# EAGLE design Interconnect (EAGLE 4.16)
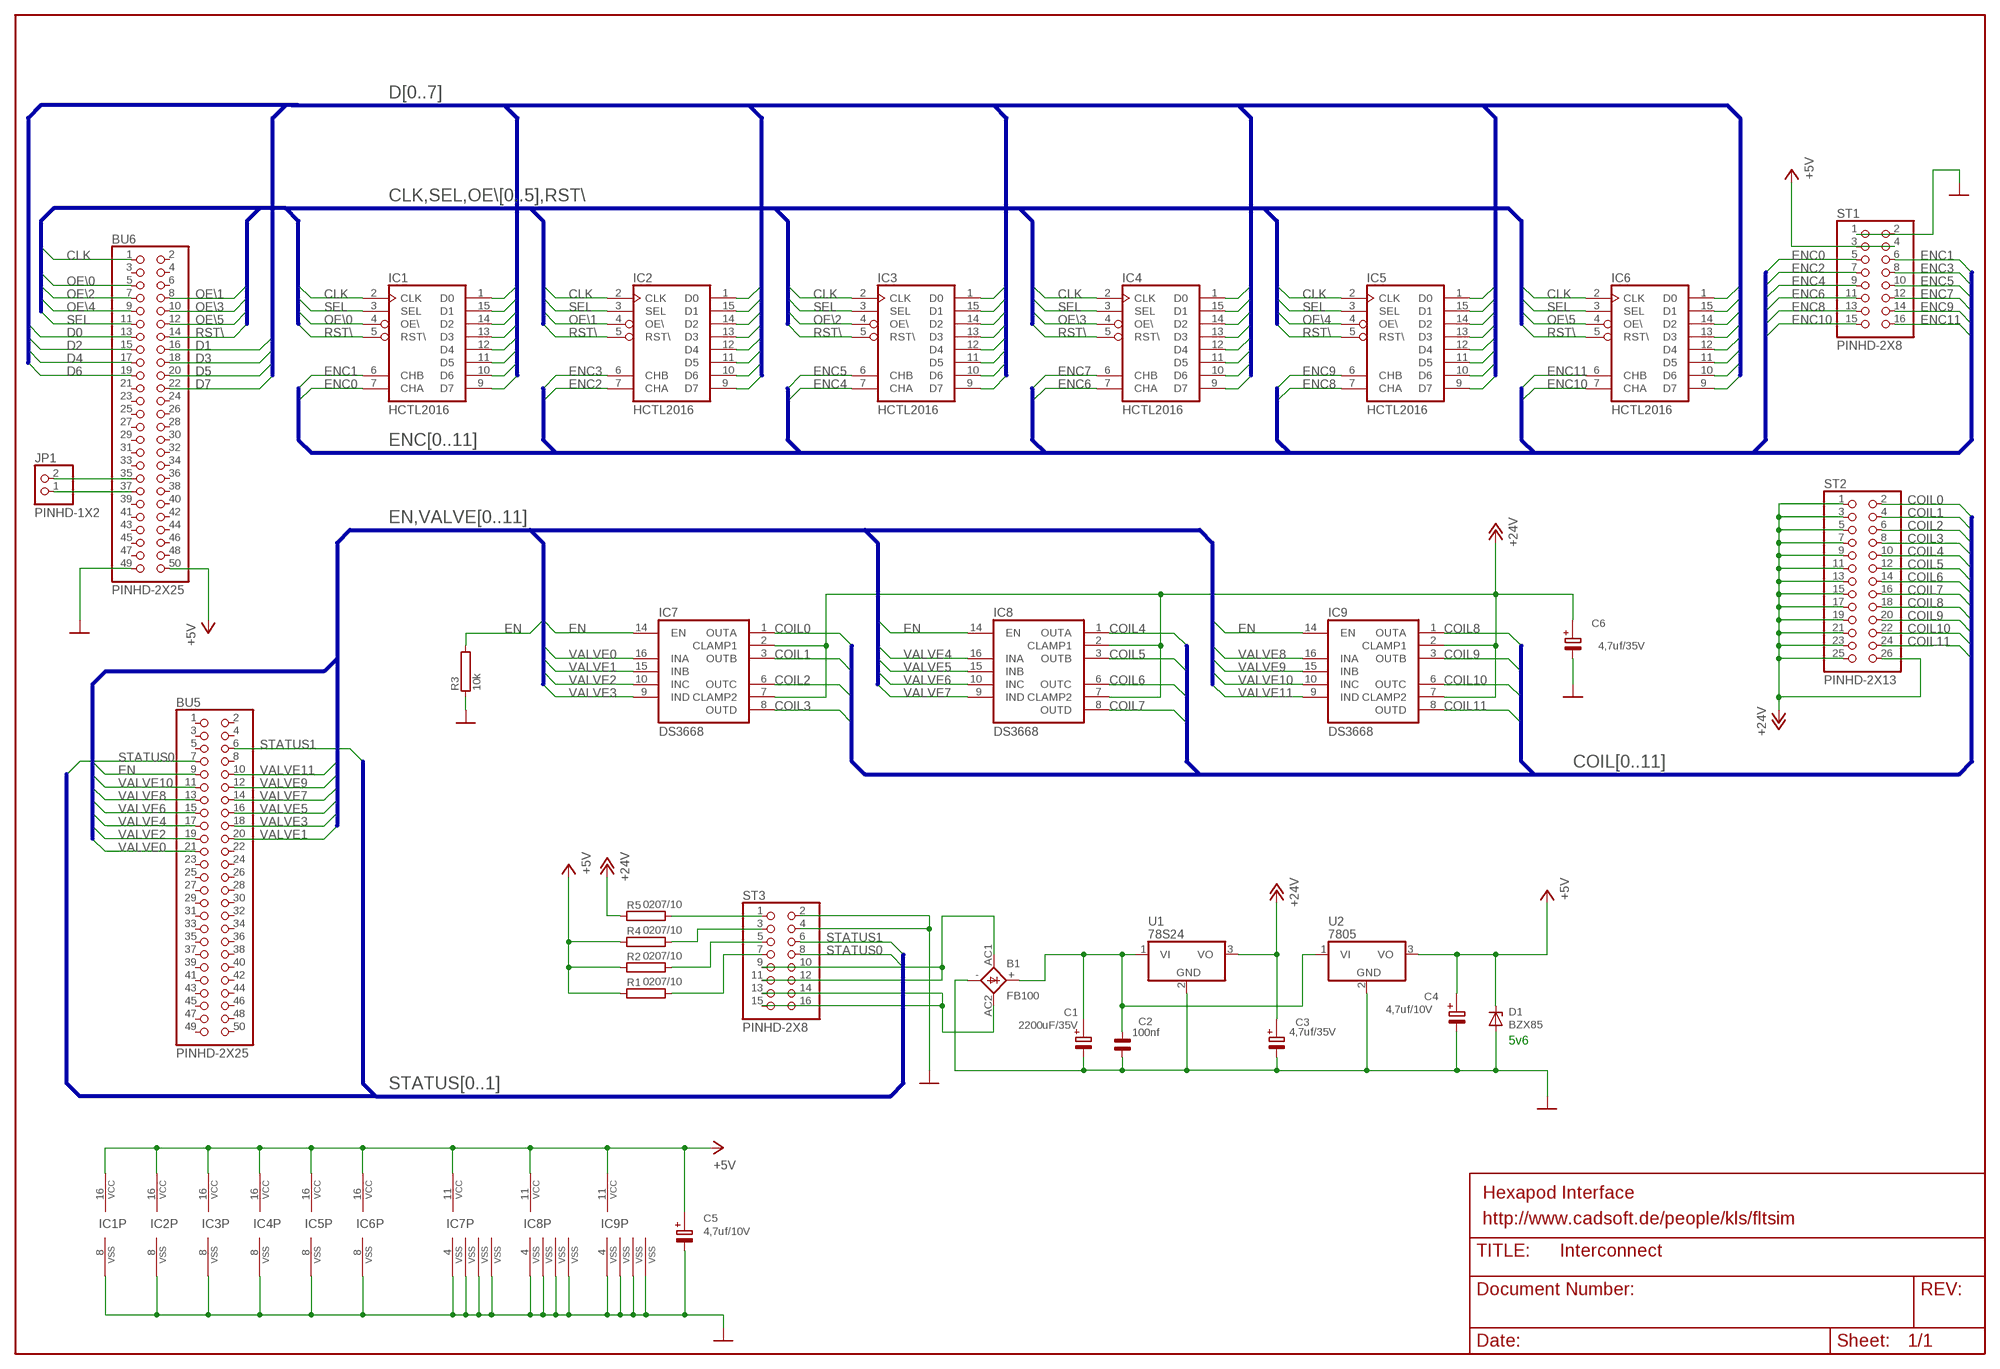
[diagram p0: schematic, sheet 1]

## Parts
B1  FB100  [FB100]
BU5  PINHD-2X25  [2X25]
BU6  PINHD-2X25  [2X25]
C1  2200uF/35V  E35-16  [E35-16]
C2  100nf  C5B2,5A  [C5B2,5A]
C3  4,7uf/35V  E2-5@1  [E2,5-5]
C4  4,7uf/10V  E2,5-5  [E2,5-5]
C5  4,7uf/10V  E2,5-5  [E2,5-5]
C6  4,7uf/35V  E2-5@1  [E2,5-5]
D1  BZX85  [DO41Z10]
IC1  HCTL2016  [DIL-16]
IC2  HCTL2016  [DIL-16]
IC3  HCTL2016  [DIL-16]
IC4  HCTL2016  [DIL-16]
IC5  HCTL2016  [DIL-16]
IC6  HCTL2016  [DIL-16]
IC7  DS3668  [DIL-16]
IC8  DS3668  [DIL-16]
IC9  DS3668  [DIL-16]
JP1  PINHD-1X2  [1X02]
R1  0207/10  [0207/10]
R2  0207/10  [0207/10]
R3  10k  0207/10@1  [0207/10@1]
R4  0207/10  [0207/10]
R5  0207/10  [0207/10]
ST1  PINHD-2X8  PINHD-2X8@1  [ML16]
ST2  PINHD-2X13  PINHD-2X13@1  [ML26]
ST3  PINHD-2X8  PINHD-2X8@1  [ML16]
U1  78S24  78XXT  [TO220H]
U2  7805  78XXT  [TO220H]

## Nets
+5V: BU6.50 C4.+ C5.+ D1.K IC1.16(VCC) IC2.16(VCC) IC3.16(VCC) IC4.16(VCC) IC5.16(VCC) IC6.16(VCC) IC7.11(VCC) IC8.11(VCC) IC9.11(VCC) R1.1 R2.1 R4.1 ST1.3 ST1.4 U2.3(VO)
+24V: C3.+ C6.+ IC7.2(CLAMP1) IC7.7(CLAMP2) IC8.2(CLAMP1) IC8.7(CLAMP2) IC9.2(CLAMP1) IC9.7(CLAMP2) R5.1 ST2.1 ST2.3 ST2.5 ST2.7 ST2.9 ST2.11 ST2.13 ST2.15 ST2.17 ST2.19 ST2.21 ST2.23 ST2.25 ST2.26 U1.3(VO)
AC1: B1.AC1 ST3.9 ST3.10 ST3.11 ST3.12
AC2: B1.AC2 ST3.13 ST3.14 ST3.15 ST3.16
CLK: BU6.1 IC1.2(CLK) IC2.2(CLK) IC3.2(CLK) IC4.2(CLK) IC5.2(CLK) IC6.2(CLK)
COIL0: IC7.1(OUTA) ST2.2
COIL1: IC7.3(OUTB) ST2.4
COIL2: IC7.6(OUTC) ST2.6
COIL3: IC7.8(OUTD) ST2.8
COIL4: IC8.1(OUTA) ST2.10
COIL5: IC8.3(OUTB) ST2.12
COIL6: IC8.6(OUTC) ST2.14
COIL7: IC8.8(OUTD) ST2.16
COIL8: IC9.1(OUTA) ST2.18
COIL9: IC9.3(OUTB) ST2.20
COIL10: IC9.6(OUTC) ST2.22
COIL11: IC9.8(OUTD) ST2.24
D0: BU6.13 IC1.1(D0) IC2.1(D0) IC3.1(D0) IC4.1(D0) IC5.1(D0) IC6.1(D0)
D1: BU6.16 IC1.15(D1) IC2.15(D1) IC3.15(D1) IC4.15(D1) IC5.15(D1) IC6.15(D1)
D2: BU6.15 IC1.14(D2) IC2.14(D2) IC3.14(D2) IC4.14(D2) IC5.14(D2) IC6.14(D2)
D3: BU6.18 IC1.13(D3) IC2.13(D3) IC3.13(D3) IC4.13(D3) IC5.13(D3) IC6.13(D3)
D4: BU6.17 IC1.12(D4) IC2.12(D4) IC3.12(D4) IC4.12(D4) IC5.12(D4) IC6.12(D4)
D5: BU6.20 IC1.11(D5) IC2.11(D5) IC3.11(D5) IC4.11(D5) IC5.11(D5) IC6.11(D5)
D6: BU6.19 IC1.10(D6) IC2.10(D6) IC3.10(D6) IC4.10(D6) IC5.10(D6) IC6.10(D6)
D7: BU6.22 IC1.9(D7) IC2.9(D7) IC3.9(D7) IC4.9(D7) IC5.9(D7) IC6.9(D7)
EN: BU5.9 IC7.14(EN) IC8.14(EN) IC9.14(EN) R3.2
ENC0: IC1.7(CHA) ST1.5
ENC1: IC1.6(CHB) ST1.6
ENC2: IC2.7(CHA) ST1.7
ENC3: IC2.6(CHB) ST1.8
ENC4: IC3.7(CHA) ST1.9
ENC5: IC3.6(CHB) ST1.10
ENC6: IC4.7(CHA) ST1.11
ENC7: IC4.6(CHB) ST1.12
ENC8: IC5.7(CHA) ST1.13
ENC9: IC5.6(CHB) ST1.14
ENC10: IC6.7(CHA) ST1.15
ENC11: IC6.6(CHB) ST1.16
GND: B1.- BU6.49 C1.- C2.1 C3.- C4.- C5.- C6.- D1.A IC1.8(VSS) IC2.8(VSS) IC3.8(VSS) IC4.8(VSS) IC5.8(VSS) IC6.8(VSS) IC7.4(VSS) IC7.5(VSS) IC7.12(VSS) IC7.13(VSS) IC8.4(VSS) IC8.5(VSS) IC8.12(VSS) IC8.13(VSS) IC9.4(VSS) IC9.5(VSS) IC9.12(VSS) IC9.13(VSS) R3.1 ST1.1 ST1.2 ST3.2 ST3.4 U1.2(GND) U2.2(GND)
N$4: R5.2 ST3.1
N$5: R4.2 ST3.3
N$6: R2.2 ST3.5
N$7: R1.2 ST3.7
N$8: BU6.35 JP1.2
N$9: BU6.37 JP1.1
OE\0: BU6.5 IC1.4(OE\)
OE\1: BU6.8 IC2.4(OE\)
OE\2: BU6.7 IC3.4(OE\)
OE\3: BU6.10 IC4.4(OE\)
OE\4: BU6.9 IC5.4(OE\)
OE\5: BU6.12 IC6.4(OE\)
RST\: BU6.14 IC1.5(RST\) IC2.5(RST\) IC3.5(RST\) IC4.5(RST\) IC5.5(RST\) IC6.5(RST\)
SEL: BU6.11 IC1.3(SEL) IC2.3(SEL) IC3.3(SEL) IC4.3(SEL) IC5.3(SEL) IC6.3(SEL)
STATUS0: BU5.7 ST3.8
STATUS1: BU5.6 ST3.6
VALVE0: BU5.21 IC7.16(INA)
VALVE1: BU5.20 IC7.15(INB)
VALVE2: BU5.19 IC7.10(INC)
VALVE3: BU5.18 IC7.9(IND)
VALVE4: BU5.17 IC8.16(INA)
VALVE5: BU5.16 IC8.15(INB)
VALVE6: BU5.15 IC8.10(INC)
VALVE7: BU5.14 IC8.9(IND)
VALVE8: BU5.13 IC9.16(INA)
VALVE9: BU5.12 IC9.15(INB)
VALVE10: BU5.11 IC9.10(INC)
VALVE11: BU5.10 IC9.9(IND)
VIN: B1.+ C1.+ C2.2 U1.1(VI) U2.1(VI)
Unconnected: BU5.1 BU5.2 BU5.3 BU5.4 BU5.5 BU5.8 BU5.22 BU5.23 BU5.24 BU5.25 BU5.26 BU5.27 BU5.28 BU5.29 BU5.30 BU5.31 BU5.32 BU5.33 BU5.34 BU5.35 BU5.36 BU5.37 BU5.38 BU5.39 BU5.40 BU5.41 BU5.42 BU5.43 BU5.44 BU5.45 BU5.46 BU5.47 BU5.48 BU5.49 BU5.50 BU6.2 BU6.3 BU6.4 BU6.6 BU6.21 BU6.23 BU6.24 BU6.25 BU6.26 BU6.27 BU6.28 BU6.29 BU6.30 BU6.31 BU6.32 BU6.33 BU6.34 BU6.36 BU6.38 BU6.39 BU6.40 BU6.41 BU6.42 BU6.43 BU6.44 BU6.45 BU6.46 BU6.47 BU6.48

## Buses
D[0..7]
CLK,SEL,OE\[0..5],RST\
ENC[0..11]
EN,VALVE[0..11]
COIL[0..11]
STATUS[0..1]

## Notes on the sheet
- 5v6
- Hexapod Interface
- http://www.cadsoft.de/people/kls/fltsim

## Library data of the parts
B1 = RECTIF:FB100
BU5 BU6 = PINHEAD:PINHD-2X25
C1 = ELKO:E35-16
C2 = CAP-WI:C5B2,5A
C3 C6 = ELKO:E2-5@1
C4 C5 = ELKO:E2,5-5
D1 = diode:BZX85
IC1-IC6 = klaus:HCTL2016
IC7-IC9 = klaus:DS3668
JP1 = PINHEAD:PINHD-1X2
R1 R2 R4 R5 = R:0207/10
R3 = R:0207/10@1
ST1 ST3 = PINHEAD:PINHD-2X8@1
ST2 = PINHEAD:PINHD-2X13@1
U1 U2 = LINEAR:78XXT

## Board
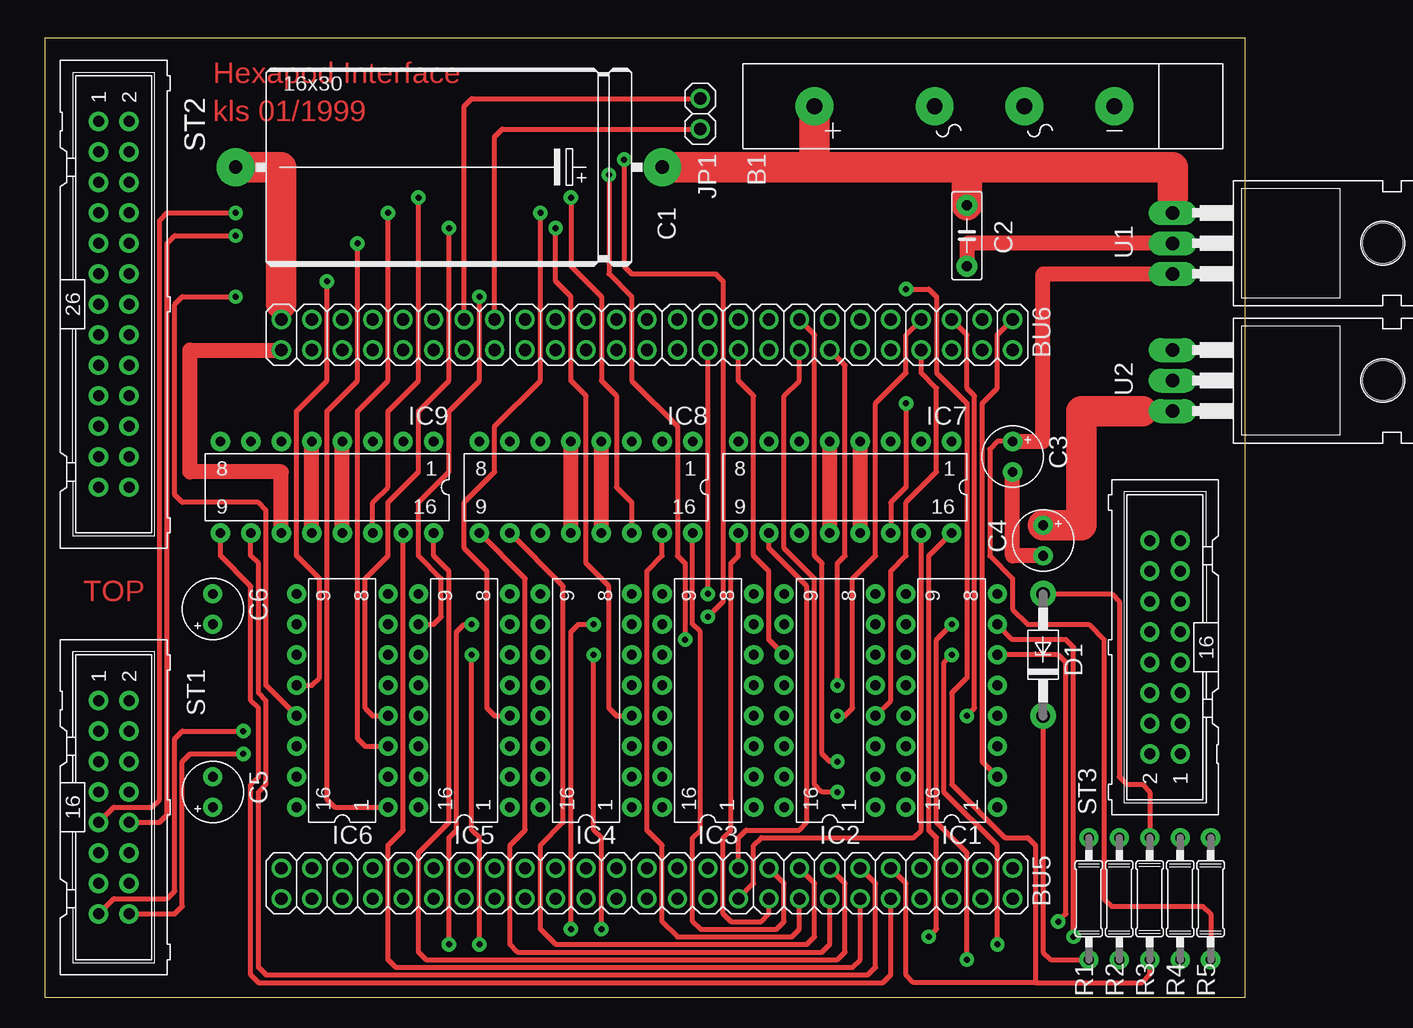
[diagram p1: board, top side]
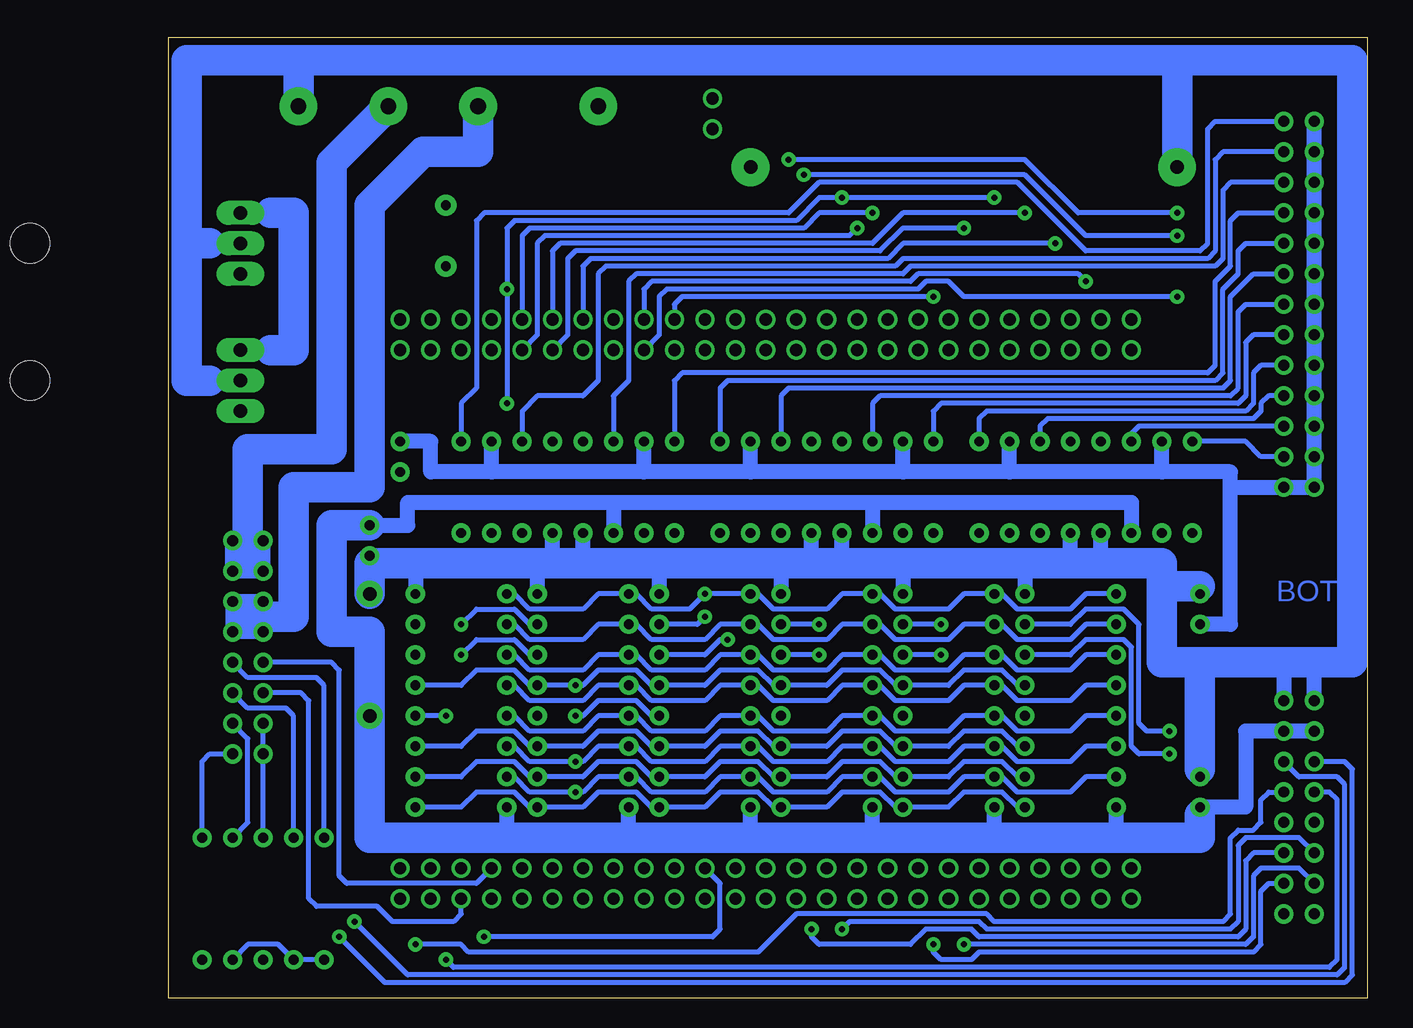
[diagram p2: board, bottom side, seen from below]

Size 100 x 80 mm. Coordinates in mm from the lower left corner, seen from the top.
Outline: 0,0 0,80 100,80 100,0 0,0
Copper layers (1*16): Top 0.035mm / dielectric 1.5mm / Bottom 0.035mm
Design rules "default": minimum track width 10mil, minimum drill 24mil, track to track 8mil, track to pad 8mil, pad to pad 8mil, via to via 8mil, smd to smd 8mil, copper to edge 40mil, drill to drill 8mil, minimum pad ring 10mil, minimum via ring 10mil, stop-mask expansion 0mil, vias tented up to drill 0mil, thermal gap 10mil

### Footprints (pad centres in the part's own frame; a part is rotated, then mirrored left to right if it is on the bottom)
FB100 = drill 1.321 pad 3.15 round: + 0,0; - 24.994,0; AC1 10.008,0; AC2 17.501,0
2X25 = drill 1.016 pad 1.6 round: 1 -30.48,-1.27; 2 -30.48,1.27; 3 -27.94,-1.27; 4 -27.94,1.27; 5 -25.4,-1.27; 6 -25.4,1.27; 7 -22.86,-1.27; 8 -22.86,1.27; 9 -20.32,-1.27; 10 -20.32,1.27; 11 -17.78,-1.27; 12 -17.78,1.27; 13 -15.24,-1.27; 14 -15.24,1.27; 15 -12.7,-1.27; 16 -12.7,1.27; 17 -10.16,-1.27; 18 -10.16,1.27; 19 -7.62,-1.27; 20 -7.62,1.27; 21 -5.08,-1.27; 22 -5.08,1.27; 23 -2.54,-1.27; 24 -2.54,1.27; 25 0,-1.27; 26 0,1.27; 27 2.54,-1.27; 28 2.54,1.27; 29 5.08,-1.27; 30 5.08,1.27; 31 7.62,-1.27; 32 7.62,1.27; 33 10.16,-1.27; 34 10.16,1.27; 35 12.7,-1.27; 36 12.7,1.27; 37 15.24,-1.27; 38 15.24,1.27; 39 17.78,-1.27; 40 17.78,1.27; 41 20.32,-1.27; 42 20.32,1.27; 43 22.86,-1.27; 44 22.86,1.27; 45 25.4,-1.27; 46 25.4,1.27; 47 27.94,-1.27; 48 27.94,1.27; 49 30.48,-1.27; 50 30.48,1.27
E35-16 = drill 1.118 pad 3.15 round: + -17.78,0; - 17.78,0
C5B2,5A = drill 0.813 pad 1.778 round: 1 -2.54,0; 2 2.54,0
E2,5-5 = drill 0.813 pad 1.6 round: + -1.27,0; - 1.27,0
DO41Z10 = drill 1.118 pad 2.159 round: A 5.08,0; K -5.08,0
DIL-16 = drill 0.813 pad 1.6 round: 1 -8.89,-3.81; 2 -6.35,-3.81; 3 -3.81,-3.81; 4 -1.27,-3.81; 5 1.27,-3.81; 6 3.81,-3.81; 7 6.35,-3.81; 8 8.89,-3.81; 9 8.89,3.81; 10 6.35,3.81; 11 3.81,3.81; 12 1.27,3.81; 13 -1.27,3.81; 14 -3.81,3.81; 15 -6.35,3.81; 16 -8.89,3.81
1X02 = drill 1.016 pad 1.6 round: 1 -1.27,0; 2 1.27,0
0207/10 = drill 0.813 pad 1.6 round: 1 -5.08,0; 2 5.08,0
0207/10@1 = drill 0.813 pad 1.6 round: 1 -5.08,0; 2 5.08,0
ML16 = drill 0.914 pad 1.6 round: 1 -8.89,-1.27; 2 -8.89,1.27; 3 -6.35,-1.27; 4 -6.35,1.27; 5 -3.81,-1.27; 6 -3.81,1.27; 7 -1.27,-1.27; 8 -1.27,1.27; 9 1.27,-1.27; 10 1.27,1.27; 11 3.81,-1.27; 12 3.81,1.27; 13 6.35,-1.27; 14 6.35,1.27; 15 8.89,-1.27; 16 8.89,1.27
ML26 = drill 0.914 pad 1.6 round: 1 -15.24,-1.27; 2 -15.24,1.27; 3 -12.7,-1.27; 4 -12.7,1.27; 5 -10.16,-1.27; 6 -10.16,1.27; 7 -7.62,-1.27; 8 -7.62,1.27; 9 -5.08,-1.27; 10 -5.08,1.27; 11 -2.54,-1.27; 12 -2.54,1.27; 13 0,-1.27; 14 0,1.27; 15 2.54,-1.27; 16 2.54,1.27; 17 5.08,-1.27; 18 5.08,1.27; 19 7.62,-1.27; 20 7.62,1.27; 21 10.16,-1.27; 22 10.16,1.27; 23 12.7,-1.27; 24 12.7,1.27; 25 15.24,-1.27; 26 15.24,1.27
TO220H = drill 1.118 pad 2 long: 1 -2.54,-6.35; 2 0,-6.35; 3 2.54,-6.35 | hole 3.302: 0,11.176

### Placement (x,y rotation side)
B1  64.14,74.3 0 top
BU5  50.16,9.53 180 top
BU6  50.16,55.24 180 top
C1  33.66,69.22 180 top
C2  76.83,63.5 90 top
C3  80.64,45.09 270 top
C4  83.19,38.1 270 top
C5  13.97,17.14 90 top
C6  13.97,32.38 90 top
D1  83.19,28.57 90 top
IC1  75.56,24.77 90 top
IC2  65.41,24.77 90 top
IC3  55.24,24.77 90 top
IC4  45.09,24.77 90 top
IC5  34.92,24.77 90 top
IC6  24.77,24.77 90 top
IC7  66.67,42.55 180 top
IC8  45.09,42.55 180 top
IC9  23.5,42.55 180 top
JP1  54.61,73.66 270 top
R1  87,8.26 90 top
R2  89.53,8.26 90 top
R3  92.08,8.26 270 top
R4  94.61,8.26 90 top
R5  97.16,8.26 90 top
ST1  5.71,15.88 270 top
ST2  5.71,57.78 270 top
ST3  93.34,29.21 90 top
U1  100.33,62.87 270 top
U2  100.33,51.44 270 top

### Tracks (layer width: path | path; a pad name or v marks a point on that pad's centre or on a via)
+5V
  Top 0.406: R1.1 83.82,3.17 83.19,3.81 D1.K
  Top 1.27: BU6.50 12.06,53.98 12.06,43.81 19.68,43.81 IC9.11 | 91.44,48.9 U2.3
  Top 2.54: C4.+ 86.36,39.37 86.36,48.9 91.44,48.9
  Bottom 0.406: R1.1 R2.1 90.81,4.45 93.34,4.45 R4.1
  Bottom 1.27: 20.95,13.34 IC6.16 | 31.11,13.34 IC5.16 | 41.27,13.34 IC4.16 | 51.44,13.34 IC3.16 | 61.59,13.34 IC2.16 | 71.75,13.34 IC1.16 | IC9.11 19.68,41.27 41.27,41.27 | 62.87,41.27 41.27,41.27 | 41.27,41.27 IC8.11 | 62.87,41.27 IC7.11 | 62.87,41.27 80.01,41.27 80.01,39.37 C4.+ | 13.97,15.24 C5.+ 10.16,15.88 10.16,22.23 ST1.4 ST1.3
  Bottom 2.54: C4.+ 86.36,39.37 86.36,30.48 83.19,30.48 D1.K 83.19,13.34 71.75,13.34 61.59,13.34 51.44,13.34 41.27,13.34 31.11,13.34 20.95,13.34 13.97,13.34 13.97,15.24
+24V
  Top 0.406: R5.1 97.16,6.99 96.52,7.62 88.9,7.62 88.27,8.26 88.27,29.84 87,31.11 81.92,31.11 80.64,32.38 80.64,34.92 78.74,36.83 78.74,45.72 79.38,46.35 C3.+
  Top 1.27: C3.+ 83.19,46.35 83.19,60.33 U1.3
  Bottom 1.27: 17.14,43.81 IC9.7 | C3.+ 78.11,46.35 78.11,43.81 73.03,43.81 | 60.33,43.81 73.03,43.81 | 51.44,43.81 60.33,43.81 | 38.73,43.81 51.44,43.81 | 29.84,43.81 38.73,43.81 | 17.14,43.81 29.84,43.81 | 29.84,43.81 IC9.2 | 38.73,43.81 IC8.7 | 51.44,43.81 IC8.2 | 60.33,43.81 IC7.7 | 73.03,43.81 IC7.2 | 17.14,43.81 11.43,43.81 11.43,42.55 | 11.43,42.55 ST2.26 ST2.25 ST2.23 ST2.21 ST2.19 ST2.17 ST2.15 ST2.13 ST2.11 ST2.9 ST2.7 ST2.5 ST2.3 ST2.1 | 11.43,42.55 11.43,31.11 C6.+
AC1
  Bottom 1.27: ST3.10 ST3.9 ST3.11 ST3.12 92.08,31.75 ST3.10
  Bottom 1.524: ST3.10 ST3.11 | ST3.12 ST3.9
  Bottom 2.54: B1.AC1 74.14,70.48 78.74,70.48 83.19,66.04 83.19,42.55 89.53,42.55 89.53,31.75 92.08,31.75
AC2
  Bottom 1.27: ST3.14 ST3.13 ST3.15 93.34,38.1 ST3.16 ST3.14
  Bottom 1.524: ST3.14 ST3.15 | ST3.13 ST3.16
  Bottom 2.54: 93.34,38.1 93.34,45.72 86.36,45.72 86.36,69.57 B1.AC2
CLK
  Top 0.406: IC1.2 78.11,19.68 78.11,49.53 79.38,50.8 79.38,55.24 BU6.1
  Bottom 0.406: IC6.2 29.21,18.41 30.48,19.68 33.66,19.68 34.92,18.41 IC5.2 39.37,18.41 40.64,19.68 43.81,19.68 45.09,18.41 IC4.2 49.53,18.41 50.8,19.68 53.98,19.68 55.24,18.41 IC3.2 59.69,18.41 60.96,19.68 64.14,19.68 65.41,18.41 IC2.2 69.85,18.41 71.12,19.68 74.3,19.68 75.56,18.41 IC1.2
COIL0
  Bottom 0.406: IC7.1 75.56,49.53 74.3,50.8 74.3,64.77 73.66,65.41 48.26,65.41 45.72,67.94 29.21,67.94 23.5,62.23 13.97,62.23 13.34,62.87 13.34,72.39 12.7,73.03 ST2.2
COIL1
  Bottom 0.406: IC7.3 70.48,48.9 69.22,50.16 65.41,50.16 64.14,51.44 64.14,60.33 63.5,60.96 39.37,60.96 38.73,61.59 13.34,61.59 12.7,62.23 12.7,69.85 12.06,70.48 ST2.4
COIL2
  Bottom 0.406: IC7.6 62.87,50.16 61.59,51.44 61.59,59.69 60.96,60.33 38.73,60.33 38.1,60.96 12.7,60.96 12.06,61.59 12.06,67.31 11.43,67.94 ST2.6
COIL3
  Bottom 0.406: ST2.8 10.79,65.41 11.43,64.77 11.43,60.96 12.7,59.69 12.7,52.7 13.34,52.07 57.15,52.07 57.78,51.44 IC7.8
COIL4
  Bottom 0.406: ST2.10 10.16,62.87 10.79,62.23 10.79,60.33 12.06,59.05 12.06,52.07 12.7,51.44 53.34,51.44 53.98,50.8 IC8.1
COIL5
  Bottom 0.406: ST2.12 9.53,60.33 11.43,58.42 11.43,51.44 12.06,50.8 48.26,50.8 48.9,50.16 IC8.3
COIL6
  Bottom 0.406: IC8.6 41.27,49.53 40.64,50.16 11.43,50.16 10.79,50.8 10.79,57.15 10.16,57.78 ST2.14
COIL7
  Bottom 0.406: IC8.8 36.2,48.9 35.56,49.53 10.79,49.53 10.16,50.16 10.16,54.61 9.53,55.24 ST2.16
COIL8
  Bottom 0.406: IC9.1 32.38,48.26 31.75,48.9 10.16,48.9 9.53,49.53 9.53,52.07 8.89,52.7 ST2.18
COIL9
  Bottom 0.406: IC9.3 27.3,47.62 26.67,48.26 9.53,48.26 8.89,48.9 8.89,49.53 8.26,50.16 ST2.20
COIL10
  Bottom 0.406: IC9.6 19.68,46.99 19.05,47.62 ST2.22
COIL11
  Bottom 0.406: ST2.24 8.89,45.09 10.16,46.35 IC9.8
D0  (via drill 0.5 pad 1.2)
  Top 0.406: IC6.1 24.13,15.88 23.5,16.51 23.5,48.9 26.04,51.44 v26.04,62.87
  Bottom 0.406: IC6.1 29.21,15.88 30.48,17.14 33.66,17.14 34.92,15.88 IC5.1 39.37,15.88 40.64,17.14 43.81,17.14 45.09,15.88 IC4.1 49.53,15.88 50.8,17.14 53.98,17.14 55.24,15.88 IC3.1 59.69,15.88 60.96,17.14 64.14,17.14 65.41,15.88 IC2.1 69.85,15.88 71.12,17.14 74.3,17.14 75.56,15.88 IC1.1 | BU6.13 65.41,60.96 64.77,61.59 40.01,61.59 38.73,62.87 v26.04,62.87
D1  (via drill 0.5 pad 1.2)
  Top 0.406: BU6.16 62.87,51.44 61.59,50.16 61.59,37.47 64.14,34.92 64.14,17.78 64.77,17.14 v66.04,17.14
  Bottom 0.406: IC6.15 23.5,18.41 24.77,17.14 29.21,17.14 30.48,18.41 IC5.15 33.66,18.41 34.92,17.14 39.37,17.14 40.64,18.41 IC4.15 43.81,18.41 45.09,17.14 49.53,17.14 50.8,18.41 IC3.15 53.98,18.41 55.24,17.14 59.69,17.14 60.96,18.41 IC2.15 64.14,18.41 65.41,17.14 v66.04,17.14 69.85,17.14 71.12,18.41 IC1.15
D2  (via drill 0.5 pad 1.2)
  Top 0.406: BU6.15 64.14,55.24 64.14,36.83 64.77,36.2 64.77,20.32 65.41,19.68 v66.04,19.68
  Bottom 0.406: IC6.14 23.5,20.95 24.77,19.68 29.21,19.68 30.48,20.95 IC5.14 33.66,20.95 34.92,19.68 39.37,19.68 40.64,20.95 IC4.14 43.81,20.95 45.09,19.68 49.53,19.68 50.8,20.95 IC3.14 53.98,20.95 55.24,19.68 59.69,19.68 60.96,20.95 IC2.14 64.14,20.95 65.41,19.68 v66.04,19.68 69.85,19.68 71.12,20.95 IC1.14
D3  (via drill 0.5 pad 1.2)
  Top 0.406: IC6.13 18.41,26.04 18.41,40.64 17.78,41.27 11.43,41.27 10.79,41.91 10.79,57.78 11.43,58.42 v15.88,58.42
  Bottom 0.406: IC6.13 23.5,23.5 24.77,22.23 29.21,22.23 30.48,23.5 IC5.13 33.66,23.5 34.92,22.23 39.37,22.23 40.64,23.5 IC4.13 43.81,23.5 45.09,22.23 49.53,22.23 50.8,23.5 IC3.13 53.98,23.5 55.24,22.23 59.69,22.23 60.96,23.5 IC2.13 64.14,23.5 65.41,22.23 69.85,22.23 71.12,23.5 IC1.13 | BU6.18 59.05,55.24 59.05,58.42 58.42,59.05 37.47,59.05 36.83,59.69 34.92,59.69 33.66,58.42 v15.88,58.42
D4  (via drill 0.5 pad 1.2)
  Top 0.406: IC6.12 22.23,26.04 22.86,26.67 22.86,34.92 20.95,36.83 20.95,48.9 23.5,51.44 v23.5,59.69
  Bottom 0.406: IC6.12 23.5,26.04 24.77,24.77 29.21,24.77 30.48,26.04 IC5.12 33.66,26.04 34.92,24.77 39.37,24.77 40.64,26.04 IC4.12 43.81,26.04 45.09,24.77 49.53,24.77 50.8,26.04 IC3.12 53.98,26.04 55.24,24.77 59.69,24.77 60.96,26.04 IC2.12 64.14,26.04 65.41,24.77 69.85,24.77 71.12,26.04 IC1.12 | BU6.17 60.33,59.05 59.69,59.69 38.1,59.69 37.47,60.33 24.13,60.33 v23.5,59.69
D5
  Top 0.406: BU6.20 57.78,51.44 59.05,50.16 59.05,36.83 60.33,35.56 60.33,29.84 IC2.11
  Bottom 0.406: IC6.11 23.5,28.57 24.77,27.3 29.21,27.3 30.48,28.57 IC5.11 33.66,28.57 34.92,27.3 39.37,27.3 40.64,28.57 IC4.11 43.81,28.57 45.09,27.3 49.53,27.3 50.8,28.57 IC3.11 53.98,28.57 55.24,27.3 59.69,27.3 60.96,28.57 IC2.11 64.14,28.57 65.41,27.3 69.85,27.3 71.12,28.57 IC1.11
D6  (via drill 0.5 pad 1.2)
  Top 0.406: IC5.10 32.38,31.11 33.02,31.75 33.02,34.92 31.11,36.83 31.11,41.27 33.66,43.81 33.66,48.9 36.2,51.44 v36.2,58.42
  Bottom 0.406: IC6.10 23.5,31.11 24.77,29.84 29.21,29.84 30.48,31.11 IC5.10 33.66,31.11 34.92,29.84 39.37,29.84 40.64,31.11 IC4.10 43.81,31.11 45.09,29.84 49.53,29.84 50.8,31.11 IC3.10 53.98,31.11 55.24,29.84 59.69,29.84 60.96,31.11 IC2.10 64.14,31.11 65.41,29.84 69.85,29.84 71.12,31.11 IC1.10 | BU6.19 57.78,57.78 57.15,58.42 v36.2,58.42
D7  (via drill 0.5 pad 1.2)
  Top 0.406: v55.24,33.66 BU6.22
  Bottom 0.406: IC6.9 23.5,33.66 24.77,32.38 29.21,32.38 30.48,33.66 IC5.9 33.66,33.66 34.92,32.38 39.37,32.38 40.64,33.66 IC4.9 43.81,33.66 45.09,32.38 49.53,32.38 50.8,33.66 IC3.9 v55.24,33.66 56.52,32.38 59.69,32.38 60.96,33.66 IC2.9 64.14,33.66 65.41,32.38 69.85,32.38 71.12,33.66 IC1.9
EN  (via drill 0.5 pad 1.2)
  Top 0.406: IC9.14 27.3,41.27 28.57,42.55 28.57,48.9 31.11,51.44 v31.11,66.67 | IC8.14 48.9,41.27 47.62,42.55 47.62,50.16 46.35,51.44 46.35,58.42 43.81,60.96 v43.81,66.67 | IC7.14 70.48,41.27 71.75,42.55 v71.75,49.53 | BU5.9 71.75,9.53 71.75,1.91 72.39,1.27 82.55,1.27 | 82.55,1.27 91.44,1.27 92.08,1.91 R3.2 | v71.75,59.05 73.66,59.05 74.3,58.42 74.3,52.07 76.83,49.53 76.83,26.67 75.56,25.4 75.56,17.78 80.01,13.34 81.92,13.34 82.55,12.7 82.55,1.27
  Bottom 0.406: v71.75,49.53 v71.75,59.05 71.75,64.14 71.12,64.77 47.62,64.77 45.72,66.67 v43.81,66.67 v31.11,66.67
ENC0  (via drill 0.5 pad 1.2)
  Top 0.406: v85.72,5.08 85.72,29.21 85.09,29.84 80.64,29.84 IC1.7
  Bottom 0.406: v85.72,5.08 81.92,1.27 1.91,1.27 1.27,1.91 1.27,19.05 1.91,19.68 ST1.5
ENC1  (via drill 0.5 pad 1.2)
  Top 0.406: IC1.6 84.45,28.57 85.09,27.94 85.09,6.99 v84.45,6.35
  Bottom 0.406: v84.45,6.35 80.01,1.91 2.54,1.91 1.91,2.54 1.91,17.78 2.54,18.41 5.71,18.41 ST1.6
ENC2  (via drill 0.5 pad 1.2)
  Top 0.406: v75.56,31.11 74.3,29.84 74.3,14.61 76.83,12.06 v76.83,3.17
  Bottom 0.406: IC2.7 69.85,31.11 71.12,32.38 74.3,32.38 v75.56,31.11 | v76.83,3.17 76.2,2.54 3.17,2.54 2.54,3.17 2.54,16.51 3.17,17.14 ST1.7
ENC3  (via drill 0.5 pad 1.2)
  Top 0.406: v75.56,28.57 74.93,27.94 74.93,17.14 79.38,12.7 v79.38,4.45
  Bottom 0.406: IC2.6 69.85,28.57 71.12,29.84 74.3,29.84 v75.56,28.57 | v79.38,4.45 75.56,4.45 74.93,3.81 50.8,3.81 47.62,6.99 31.75,6.99 31.11,6.35 12.06,6.35 11.43,6.99 11.43,13.34 10.79,13.97 9.53,13.97 8.89,14.61 8.89,16.51 8.26,17.14 ST1.8
ENC4  (via drill 0.5 pad 1.2)
  Top 0.406: v55.24,31.75 56.52,33.02 56.52,59.69 55.88,60.33 48.9,60.33 48.26,60.96 v48.26,69.85 | v15.88,65.41 10.16,65.41 9.53,64.77 9.53,16.51 8.89,15.88 5.71,15.88 ST1.9
  Bottom 0.406: IC3.7 55.88,31.11 v55.24,31.75 | v15.88,65.41 24.13,65.41 28.57,69.85 v48.26,69.85
ENC5  (via drill 0.5 pad 1.2)
  Top 0.406: v15.88,63.5 10.79,63.5 10.16,62.87 10.16,15.24 9.53,14.61 ST1.10 | v46.99,68.58 46.99,60.33 48.9,58.42 48.9,51.44 52.7,47.62 52.7,36.83 53.34,36.2 v53.34,29.84
  Bottom 0.406: v15.88,63.5 23.5,63.5 28.57,68.58 v46.99,68.58 | IC3.6 55.24,28.57 53.98,29.84 v53.34,29.84
ENC6  (via drill 0.5 pad 1.2)
  Top 0.406: v45.72,31.11 44.45,31.11 43.81,30.48 v43.81,5.71
  Bottom 0.406: v45.72,31.11 IC4.7 | v43.81,5.71 43.18,6.35 32.38,6.35 31.75,5.71 11.43,5.71 10.79,6.35 10.79,12.7 10.16,13.34 5.71,13.34 ST1.11
ENC7  (via drill 0.5 pad 1.2)
  Top 0.406: v46.35,5.71 46.35,13.34 45.72,13.97 v45.72,28.57
  Bottom 0.406: v45.72,28.57 IC4.6 | v46.35,5.71 46.35,5.08 45.72,4.45 38.1,4.45 36.83,5.71 33.02,5.71 32.38,5.08 10.79,5.08 10.16,5.71 10.16,11.43 9.53,12.06 ST1.12
ENC8  (via drill 0.5 pad 1.2)
  Top 0.406: v35.56,31.11 34.92,31.11 34.29,30.48 34.29,13.97 33.66,13.34 v33.66,4.45
  Bottom 0.406: v35.56,31.11 IC5.7 | v33.66,4.45 10.16,4.45 9.53,5.08 9.53,10.16 8.89,10.79 5.71,10.79 ST1.13
ENC9  (via drill 0.5 pad 1.2)
  Top 0.406: v36.2,4.45 36.2,13.34 35.56,13.97 v35.56,28.57
  Bottom 0.406: v35.56,28.57 IC5.6 | v36.2,4.45 36.2,3.81 35.56,3.17 33.02,3.17 32.38,3.81 9.53,3.81 8.89,4.45 8.89,8.89 8.26,9.53 ST1.14
ENC10  (via drill 0.5 pad 1.2)
  Top 0.406: v16.51,22.23 11.43,22.23 10.79,21.59 10.79,8.89 10.16,8.26 5.71,8.26 ST1.15
  Bottom 0.406: IC6.7 24.77,31.11 23.5,32.38 20.32,32.38 19.05,31.11 19.05,22.86 18.41,22.23 v16.51,22.23
ENC11  (via drill 0.5 pad 1.2)
  Top 0.406: v16.51,20.32 12.06,20.32 11.43,19.68 11.43,7.62 10.79,6.99 ST1.16
  Bottom 0.406: IC6.6 24.77,28.57 23.5,29.84 20.32,29.84 19.68,29.21 19.68,20.95 19.05,20.32 v16.51,20.32
GND
  Top 0.406: R3.1 92.08,17.14 91.44,17.78 90.17,17.78 89.53,18.41 89.53,33.02 88.9,33.66 D1.A
  Top 1.27: IC9.12 IC9.5 | IC8.12 IC8.5 | IC7.12 IC7.5 | IC9.13 IC9.4 | IC8.13 IC8.4 | IC7.13 IC7.4 | 19.68,57.78 BU6.49 | C2.1 76.83,62.87 U1.2 | C3.- 80.64,36.83 C4.-
  Top 2.54: C1.- 19.68,69.22 19.68,57.78
  Bottom 0.406: ST3.4 ST3.2 R3.1
  Bottom 1.27: 28.57,36.2 IC6.8 | 38.73,36.2 IC5.8 | 48.9,36.2 IC4.8 | 59.05,36.2 IC3.8 | 69.22,36.2 IC2.8 | 79.38,36.2 IC1.8 | 67.94,36.2 IC7.13 | 46.35,36.2 IC8.13 | 24.77,36.2 IC9.13 | 22.23,36.2 IC9.12 | 43.81,36.2 IC8.12 | 65.41,36.2 IC7.12 | 13.97,19.05 C5.- | 13.97,34.29 C6.- | 83.19,36.2 C4.- | 96.52,62.87 U1.2 | 96.52,51.44 U2.2 | ST1.1 4.45,27.94 | 6.99,27.94 ST1.2
  Bottom 2.54: 15.88,78.11 C1.- | 13.97,19.05 13.97,24.77 13.97,27.94 | D1.A 83.19,36.2 79.38,36.2 69.22,36.2 67.94,36.2 65.41,36.2 59.05,36.2 48.9,36.2 46.35,36.2 43.81,36.2 38.73,36.2 28.57,36.2 24.77,36.2 22.23,36.2 17.14,36.2 17.14,34.29 | 17.14,34.29 17.14,27.94 13.97,27.94 | 17.14,34.29 13.97,34.29 | B1.- 89.13,78.11 88.9,78.11 | 15.88,78.11 88.9,78.11 | 98.42,62.87 98.42,51.44 96.52,51.44 | 98.42,62.87 96.52,62.87 | 88.9,78.11 98.42,78.11 98.42,62.87 | 15.88,78.11 1.27,78.11 1.27,27.94 4.45,27.94 6.99,27.94 13.97,27.94
N$4
  Bottom 0.406: ST3.1 96.52,20.32 97.16,19.68 R5.2
N$5
  Bottom 0.406: ST3.3 93.34,21.59 93.34,14.61 R4.2
N$6
  Bottom 0.406: ST3.5 93.34,24.13 90.17,24.13 89.53,23.5 R2.2
N$7
  Bottom 0.406: ST3.7 93.34,26.67 87.63,26.67 87,26.04 R1.2
N$8
  Top 0.406: BU6.35 37.47,71.75 38.1,72.39 JP1.2
N$9
  Top 0.406: BU6.37 34.92,74.3 35.56,74.93 JP1.1
OE\0  (via drill 0.5 pad 1.2)
  Top 0.406: BU6.5 76.83,55.24 76.83,50.8 77.47,50.16 77.47,24.13 v76.83,23.5
  Bottom 0.406: v76.83,23.5 IC1.4
OE\1
  Top 0.406: IC2.4 70.48,24.77 70.48,35.56 71.75,36.83 71.75,41.27 74.3,43.81 74.3,50.8 73.03,52.07 BU6.8
OE\2  (via drill 0.5 pad 1.2)
  Top 0.406: v66.04,23.5 66.67,23.5 67.31,24.13 67.31,34.92 69.22,36.83 69.22,49.53 71.75,52.07 71.75,55.24 BU6.7
  Bottom 0.406: IC3.4 59.69,23.5 60.96,24.77 64.14,24.77 65.41,23.5 v66.04,23.5
OE\3  (via drill 0.5 pad 1.2)
  Top 0.406: IC4.4 47.62,23.5 46.99,24.13 46.99,34.29 45.09,36.2 45.09,50.16 43.81,51.44 43.81,58.42 42.55,59.69 v42.55,64.14
  Bottom 0.406: BU6.10 69.22,55.24 69.22,62.87 68.58,63.5 43.18,63.5 v42.55,64.14
OE\4  (via drill 0.5 pad 1.2)
  Top 0.406: IC5.4 37.47,23.5 36.83,24.13 36.83,35.56 34.92,37.47 34.92,41.27 37.47,43.81 37.47,47.62 41.27,51.44 v41.27,65.41
  Bottom 0.406: BU6.9 70.48,63.5 69.85,64.14 46.99,64.14 45.72,65.41 v41.27,65.41
OE\5  (via drill 0.5 pad 1.2)
  Top 0.406: IC6.4 27.3,23.5 26.67,24.13 26.67,34.92 28.57,36.83 28.57,41.27 31.11,43.81 31.11,48.9 33.66,51.44 v33.66,64.14
  Bottom 0.406: BU6.12 66.67,55.24 66.67,61.59 66.04,62.23 40.64,62.23 38.73,64.14 v33.66,64.14
RST\  (via drill 0.5 pad 1.2)
  Top 0.406: BU6.14 66.67,52.7 66.67,36.83 66.04,36.2 v66.04,26.04
  Bottom 0.406: IC6.5 29.21,26.04 30.48,27.3 33.66,27.3 34.92,26.04 IC5.5 39.37,26.04 40.64,27.3 43.81,27.3 45.09,26.04 IC4.5 49.53,26.04 50.8,27.3 53.98,27.3 55.24,26.04 IC3.5 59.69,26.04 60.96,27.3 64.14,27.3 65.41,26.04 v66.04,26.04 IC2.5 69.85,26.04 71.12,27.3 74.3,27.3 75.56,26.04 IC1.5
SEL  (via drill 0.5 pad 1.2)
  Top 0.406: IC6.3 26.67,20.95 26.04,21.59 26.04,48.9 28.57,51.44 v28.57,65.41
  Bottom 0.406: IC6.3 29.21,20.95 30.48,22.23 33.66,22.23 34.92,20.95 IC5.3 39.37,20.95 40.64,22.23 43.81,22.23 45.09,20.95 IC4.3 49.53,20.95 50.8,22.23 53.98,22.23 55.24,20.95 IC3.3 59.69,20.95 60.96,22.23 64.14,22.23 65.41,20.95 IC2.3 69.85,20.95 71.12,22.23 74.3,22.23 75.56,20.95 IC1.3 | BU6.11 67.94,62.23 67.31,62.87 41.27,62.87 38.73,65.41 v28.57,65.41
STATUS0
  Bottom 0.406: ST3.8 86.36,27.94 85.72,27.3 85.72,10.16 85.09,9.53 74.3,9.53 BU5.7
STATUS1
  Bottom 0.406: ST3.6 88.9,25.4 88.27,24.77 88.27,8.26 87.63,7.62 82.55,7.62 81.28,6.35 76.2,6.35 75.56,6.99 BU5.6
VALVE0  (via drill 0.5 pad 1.2)
  Top 0.406: IC7.16 73.66,36.83 73.66,13.97 74.3,13.34 74.3,5.71 v73.66,5.08
  Bottom 0.406: BU5.21 53.98,9.53 53.98,5.71 54.61,5.08 v73.66,5.08
VALVE1
  Top 0.406: IC7.15 73.03,13.97 72.39,13.34 59.69,13.34 59.05,12.7 59.05,9.53 BU5.20
VALVE2
  Top 0.406: BU5.19 57.78,13.34 58.42,13.97 62.87,13.97 63.5,14.61 63.5,34.29 60.33,37.47 IC7.10
VALVE3
  Top 0.406: IC7.9 57.78,36.83 57.15,36.2 57.15,13.97 56.52,13.34 56.52,6.99 57.15,6.35 59.69,6.35 60.33,6.99 BU5.18
VALVE4
  Top 0.406: IC8.16 53.98,31.11 54.61,30.48 54.61,13.97 53.98,13.34 53.98,6.35 54.61,5.71 60.96,5.71 61.59,6.35 61.59,9.53 BU5.17
VALVE5
  Top 0.406: IC8.15 51.44,36.83 50.16,35.56 50.16,13.97 51.44,12.7 51.44,6.35 52.7,5.08 62.23,5.08 62.87,5.71 BU5.16
VALVE6
  Top 0.406: BU5.15 64.14,9.53 64.14,5.08 63.5,4.45 42.55,4.45 41.27,5.71 41.27,12.7 43.18,14.61 43.18,34.29 IC8.10
VALVE7
  Top 0.406: IC8.9 40.01,34.92 40.01,13.97 38.73,12.7 38.73,4.45 39.37,3.81 64.77,3.81 65.41,4.45 BU5.14
VALVE8
  Top 0.406: IC9.16 32.38,36.83 33.66,35.56 33.66,14.61 31.11,12.06 31.11,3.81 31.75,3.17 66.04,3.17 66.67,3.81 66.67,9.53 BU5.13
VALVE9
  Top 0.406: IC9.15 29.84,13.97 28.57,12.7 28.57,3.17 29.21,2.54 67.31,2.54 67.94,3.17 BU5.12
VALVE10
  Top 0.406: IC9.10 17.14,36.83 17.78,36.2 17.78,25.4 18.41,24.77 18.41,17.78 17.78,17.14 17.78,2.54 18.41,1.91 68.58,1.91 69.22,2.54 69.22,9.53 BU5.11
VALVE11
  Top 0.406: IC9.9 14.61,36.83 17.14,34.29 17.14,24.77 17.78,24.13 17.78,18.41 17.14,17.78 17.14,1.91 17.78,1.27 69.85,1.27 70.48,1.91 BU5.10
VIN
  Top 1.27: 93.98,66.67 U1.1
  Top 2.54: C1.+ 64.14,69.22 | 64.14,69.22 B1.+ | 64.14,69.22 77.47,69.22 | 77.47,69.22 93.98,69.22 93.98,66.67 | 77.47,69.22 76.83,69.22 C2.2
  Bottom 1.27: 91.44,53.98 U2.1 | U1.1 91.44,65.41
  Bottom 2.54: 91.44,53.98 89.53,53.98 89.53,65.41 91.44,65.41

### Text on the board
Top: Hexapod Interface | kls 01/1999 | TOP
Bottom: BOT